# EAGLE schematic Ventilation (EAGLE 6.5.0)
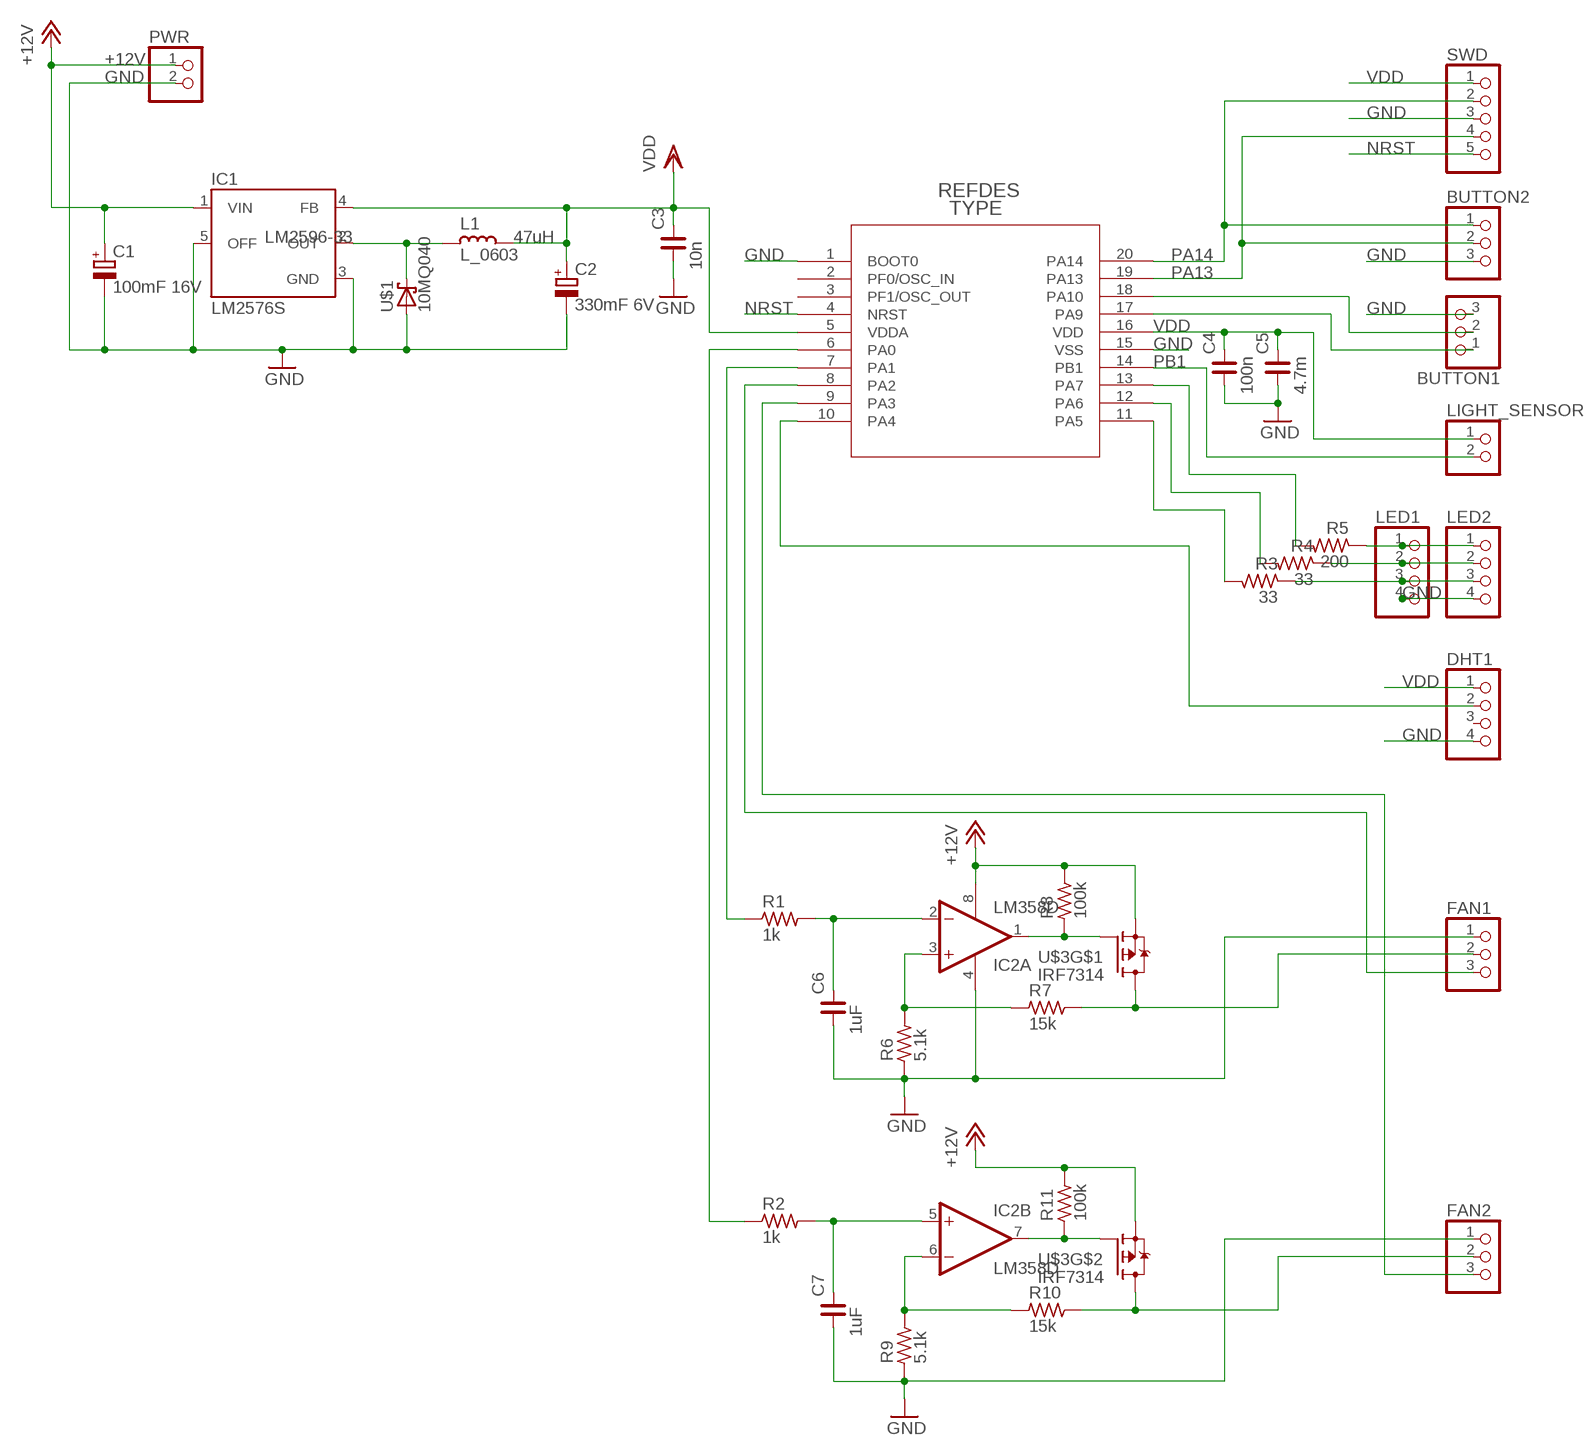
[diagram p0: schematic, sheet 1]

## Parts
BUTTON1  PINHD-1X03_2.54-S  [1X03-S]
BUTTON2  PINHD-1X03_2.54-S  [1X03-S]
C1  100mF 16V  CPOL-EUSMCD  [SMC_D]
C2  330mF 6V  CPOL-EUSMCD  [SMC_D]
C3  10n  C_1206  [C1206]
C4  100n  C_1206  [C1206]
C5  4.7m  C_1206  [C1206]
C6  1uF  C_0805  [C0805]
C7  1uF  C_0805  [C0805]
DHT1  PINHD-1X04_2.54-S  [1X04-S]
FAN1  PINHD-1X03_2.54-S  [1X03-S]
FAN2  PINHD-1X03_2.54-S  [1X03-S]
IC1  LM2576S  [TO263-5]
IC2  LM358D  [SO08]
L1  L_0603  [L0603]
LED1  PINHD-1X04_2.54-S  [1X04-S]
LED2  PINHD-1X04_2.54-S  [1X04-S]
LIGHT_SENSOR  PINHD-1X02_2.54-S  [1X02-S]
PWR  PINHD-1X02_2.54-S  [1X02-S]
R1  1k  R_0805  [R0805]
R2  1k  R_0805  [R0805]
R3  33  R_0805  [R0805]
R4  33  R_0805  [R0805]
R5  200  R_0805  [R0805]
R6  5.1k  R_0805  [R0805]
R7  15k  R_0805  [R0805]
R8  100k  R_0805  [R0805]
R9  5.1k  R_0805  [R0805]
R10  15k  R_0805  [R0805]
R11  100k  R_0805  [R0805]
SWD  PINHD-1X05_2.54-S  [1X05-S]
U$1  10MQ040  [SMA]
U$2  STM32F050F4P6  [TSSOP20]
U$3  IRF7314  [SO-8]

## Nets
+12V: C1.+ IC1.1(VIN) IC2.8(P:V+) PWR.1 R8.2 R11.2 U$3.1(S) U$3.3(S)
GND: BUTTON1.3 BUTTON2.3 C1.- C2.- C3.1 C4.1 C5.1 C6.1 C7.1 DHT1.4 FAN1.1 FAN2.1 IC1.3(GND) IC1.5(OFF) IC2.4(P:V-) LED1.4 LED2.4 PWR.2 R6.1 R9.1 SWD.3 U$1.A U$2.1(BOOT0) U$2.15(VSS)
N$1: R1.1 U$2.7(PA1)
N$2: C6.2 IC2.2(A:-IN) R1.2
N$3: C7.2 IC2.5(B:+IN) R2.2
N$4: IC2.3(A:+IN) R6.2 R7.1
N$5: R2.1 U$2.6(PA0)
N$6: IC2.7(B:OUT) R11.1 U$3.4(G)
N$7: LED1.1 LED2.1 R5.1
N$8: FAN2.3 U$2.9(PA3)
N$9: FAN1.3 U$2.8(PA2)
N$10: DHT1.2 U$2.10(PA4)
N$11: IC1.2(OUT) L1.2 U$1.C
N$12: LED1.2 LED2.2 R4.1
N$13: LED1.3 LED2.3 R3.1
N$14: R5.2 U$2.13(PA7)
N$15: R4.2 U$2.12(PA6)
N$16: R3.2 U$2.11(PA5)
N$17: BUTTON1.1 U$2.17(PA9)
N$18: BUTTON1.2 U$2.18(PA10)
N$19: IC2.1(A:OUT) R8.1 U$3.2(G)
N$20: FAN1.2 R7.2 U$3.7(D) U$3.8(D)
N$21: FAN2.2 R10.2 U$3.5(D) U$3.6(D)
N$22: IC2.6(B:-IN) R9.2 R10.1
NRST: SWD.5 U$2.4(NRST)
PA13: BUTTON2.2 SWD.4 U$2.19(PA13)
PA14: BUTTON2.1 SWD.2 U$2.20(PA14)
PB1: LIGHT_SENSOR.2 U$2.14(PB1)
VDD: C2.+ C3.2 C4.2 C5.2 DHT1.1 IC1.4(FB) L1.1 LIGHT_SENSOR.1 SWD.1 U$2.5(VDDA) U$2.16(VDD)
Unconnected: DHT1.3 U$2.2(PF0/OSC_IN) U$2.3(PF1/OSC_OUT)

## Library data of the parts
BUTTON1 BUTTON2 FAN1 FAN2 = pinhead-2:PINHD-1X03: PIN HEADER
C1 C2 = rcl:CPOL-EU: POLARIZED CAPACITOR, European symbol
C3-C7 = rc-master-smd:C_: NON-POLARIZED CAP
DHT1 LED1 LED2 = pinhead-2:PINHD-1X04: PIN HEADER
IC1 = v-reg-3:LM2576: National Semiconductor <http://www.national.com> 3.0A "Simple Switcher"(c) 52kHz, Vout 1.23-37V (HV: 57V), Vin 40V (HV: 60V), 50µA standby current; LM2596-33: LM2596-33
IC2 = linear:LM358: OP AMP also LM158; LM258; LM2904 Source: http://cache.national.com/ds/LM/LM158.pdf
L1 = rc-master-smd:L_: INDUCTOR; LCN0603T-47NJ-N: 47uH
LIGHT_SENSOR PWR = pinhead-2:PINHD-1X02: PIN HEADER
R1-R11 = rc-master-smd:R_: RESISTOR
SWD = pinhead-2:PINHD-1X05: PIN HEADER
U$1 = diode:10MQ040
U$2 = STM32F0:STM32F050F4P6: STM32F050F4P6
U$3 = transistor-fet:IRF7314